# EAGLE design SoilMoistureMan (EAGLE 6.5.0)
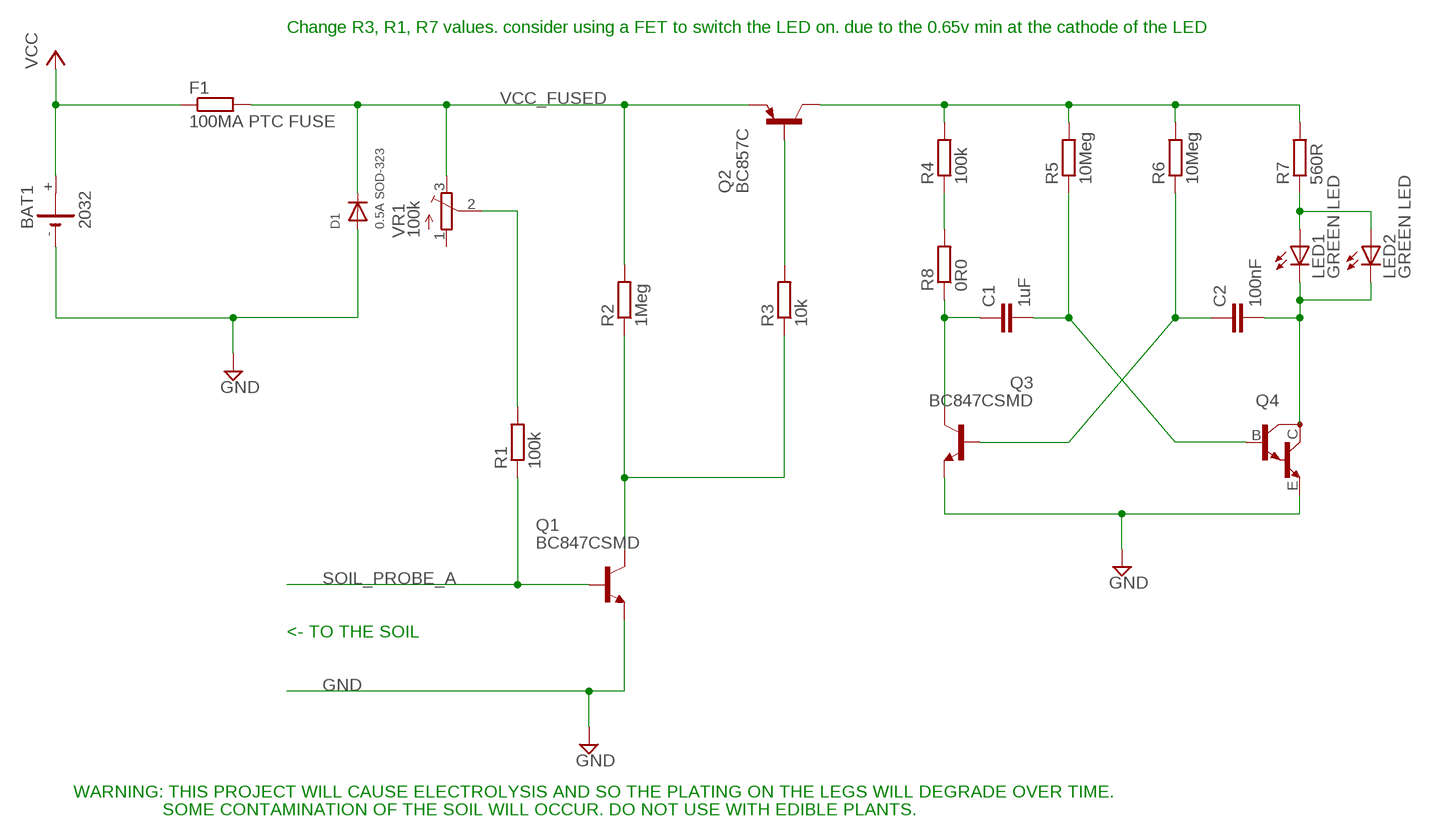
[diagram p0: schematic, sheet 1]

## Parts
BAT1  2032  [KZH20SMD]
C1  1uF  C-EUC0603  [C0603]
C2  100nF  C-EUC0603  [C0603]
D1  0.5A SOD-323  DIODESOD-323F  [SOD-323F]
F1  100MA PTC FUSE  R-EU_R0805  [R0805]
LED1  GREEN LED  LEDP-LCC-2  [P-LCC-2]
LED2  GREEN LED  LEDP-LCC-2  [P-LCC-2]
Q1  BC847CSMD  [SOT23]
Q2  BC857C  BC857C-PNP-SOT23-BEC  [SOT23-BEC]
Q3  BC847CSMD  [SOT23]
Q4  MMBTA13LT1  [SOT23-BEC]
R1  100k  R-EU_R0603  [R0603]
R2  1Meg  R-EU_R0603  [R0603]
R3  10k  R-EU_R0603  [R0603]
R4  100k  R-EU_R0603  [R0603]
R5  10Meg  R-EU_R0603  [R0603]
R6  10Meg  R-EU_R0603  [R0603]
R7  560R  R-EU_R0603  [R0603]
R8  0R0  R-EU_R0603  [R0603]
VR1  100k  TRIMPOTTC33X  [TC33X]

## Nets
GND: BAT1.- D1.A Q1.2(E) Q3.2(E) Q4.E
N$1: Q2.C R4.2 R5.2 R6.2 R7.2
N$2: R4.1 R8.2
N$3: Q2.B R3.2
N$5: LED1.A LED2.A R7.1
N$7: C1.1 Q3.3(C) R8.1
N$9: R1.2 VR1.2(S)
N$10: C2.1 Q3.1(B) R6.1
N$11: C2.2 LED1.C LED2.C Q4.C
N$12: C1.2 Q4.B R5.1
N$13: Q1.3(C) R2.1 R3.1
SOIL_PROBE_A: Q1.1(B) R1.1
VCC: BAT1.+ F1.1
VCC_FUSED: D1.C F1.2 Q2.E R2.2 VR1.3(E)
Unconnected: VR1.1(A)

## Notes on the sheet
- Change R3, R1, R7 values. consider using a FET to switch the LED on. due to the 0.65v min at the cathode of the LED
- <- TO THE SOIL
- WARNING: THIS PROJECT WILL CAUSE ELECTROLYSIS AND SO THE PLATING ON THE LEGS WILL DEGRADE OVER TIME.
- SOME CONTAMINATION OF THE SOIL WILL OCCUR. DO NOT USE WITH EDIBLE PLANTS.

## Library data of the parts
BAT1 = kzh20_lithium_batterie_holder:2032; MF: RENATA; MPN: SMTU 2032-LF; OC_FARNELL: 1216354
C1 = resistor:C-EU: CAPACITOR, European symbol; MF: TDK; MPN: C1608X5R1C105K080AA; OC_FARNELL: 2211167
C2 = resistor:C-EU: CAPACITOR, European symbol; MF: MULTICOMP; MPN: MC0603B104K160CT; OC_FARNELL: 1759016
D1 = adafruit:DIODE: Diode SMADIODE - SMA Surface Mount Package 20V 1A Schottky Diode Digikey: 641-1014-6-ND DO-1N4148 - Through Hole Small Current Diode SOD-123 20V 1 A (.5mV Vf) Schottky Diode - Digikey: MBRX120TPMSCT-ND SOD-323 10V 570mA (.38mV Vf, 3ns) Schottky Diode - Digikey: ZLLS410CT-ND SOD-523 30V 30mA Schottky Diode (RB751S-40TE61) - Digikey: RB751S-40TE61CT-ND SOT23-R/W - SOT23 Package (R = Solder Paste/Reflow Ovens, W = Hand-Soldering) BAT54Film 40V 300mA - Digikey: 497-7162-1-ND; MF: NXP; MPN: PMEG3010EJ,115; OC_FARNELL: 1757770
F1 = rcl:R-EU_: RESISTOR, European symbol; MF: BOURNS; MPN: MF-PSMF010X-2; OC_FARNELL: 1294873
LED1 LED2 = P-LCC-2_Shorter:LED: LED OSRAM: - CHIPLED LG R971, LG N971, LY N971, LG Q971, LY Q971, LO R971, LY R971 LH N974, LH R974 LS Q976, LO Q976, LY Q976 LO Q996 - Hyper CHIPLED LW Q18S LB Q993, LB Q99A, LB R99A - SideLED LS A670, LO A670, LY A670, LG A670, LP A670 LB A673, LV A673, LT A673, LW A673 LH A674 LY A675 LS A676, LA A676, LO A676, LY A676, LW A676 LS A679, LY A679, LG A679 - Hyper Micro SIDELED® LS Y876, LA Y876, LO Y876, LY Y876 LT Y87S - SmartLED LW L88C, LW L88S LB L89C, LB L89S, LG L890 LS L89K, LO L89K, LY L89K LS L896, LA L896, LO L896, LY L896 - TOPLED LS T670, LO T670, LY T670, LG T670, LP T670 LSG T670, LSP T670, LSY T670, LOP T670, LYG T670 LG T671, LOG T671, LSG T671 LB T673, LV T673, LT T673, LW T673 LH T674 LS T676, LA T676, LO T676, LY T676, LB T676, LH T676, LSB T676, LW T676 LB T67C, LV T67C, LT T67C, LS T67K, LO T67K, LY T67K, LW E67C LS E67B, LA E67B, LO E67B, LY E67B, LB E67C, LV E67C, LT E67C LW T67C LS T679, LY T679, LG T679 LS T770, LO T770, LY T770, LG T770, LP T770 LB T773, LV T773, LT T773, LW T773 LH T774 LS E675, LA E675, LY E675, LS T675 LS T776, LA T776, LO T776, LY T776, LB T776 LHGB T686 LT T68C, LB T68C - Hyper Mini TOPLED® LB M676 - Mini TOPLED Santana® LG M470 LS M47K, LO M47K, LY M47K Source: http://www.osram.convergy.de/; MF: OSRAM; MPN: LGT67K-H2K1-24-Z; OC_FARNELL: 1226376
Q1 Q3 = transistor-npn:BC847*: NPN Transistor; MF: DIODES INC.; MPN: BC847C-7-F; OC_FARNELL: 1773609
Q2 = transistor:*-PNP-: PNP Transistror; MF: DIODES INC.; MPN: BC857C-7-F; OC_FARNELL: 1773640
Q4 = transistor-npn:MMBTA13*: NPN Darlington Transistor; MF: FAIRCHILD SEMICONDUCTOR; MPN: BCV27; OC_FARNELL: 9846689
R1 R4 = resistor:R-EU_: RESISTOR, European symbol; MF: TE CONNECTIVITY; MPN: CRGH0603J100K; OC_FARNELL: 2331753
R2 = resistor:R-EU_: RESISTOR, European symbol; MF: TE CONNECTIVITY; MPN: CRGH0603J1M0; OC_FARNELL: 2331766
R3 = resistor:R-EU_: RESISTOR, European symbol; MF: BOURNS; MPN: CR0603-JW-103GLF; OC_FARNELL: 2333522
R5 R6 = resistor:R-EU_: RESISTOR, European symbol; MF: MULTICOMP; MPN: MC0063W0603110M0; OC_FARNELL: 2141628
R7 = resistor:R-EU_: RESISTOR, European symbol; MF: TE CONNECTIVITY; MPN: CRGH0603J560R; OC_FARNELL: 2331724
R8 = resistor:R-EU_: RESISTOR, European symbol; MF: MULTICOMP; MPN: MC0603SAF0000T5E; OC_FARNELL: 2309111
VR1 = P-LCC-2_Shorter:TRIMPOT: SMT trimmer potentiometer part number TC33X http://www.ladyada.net/library/eagle; MF: VISHAY SFERNICE; MPN: TS53YJ104MR10; OC_FARNELL: 1141488

## Net classes
0 default: width 0.305 mm, drill 0.508 mm, clearance 0.254 mm

## Board
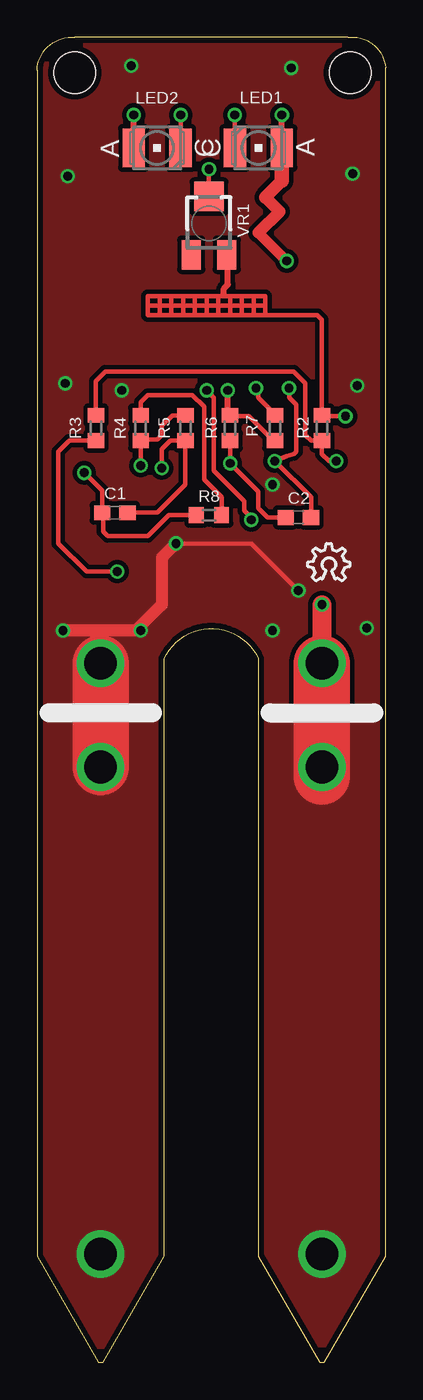
[diagram p1: board, top side]
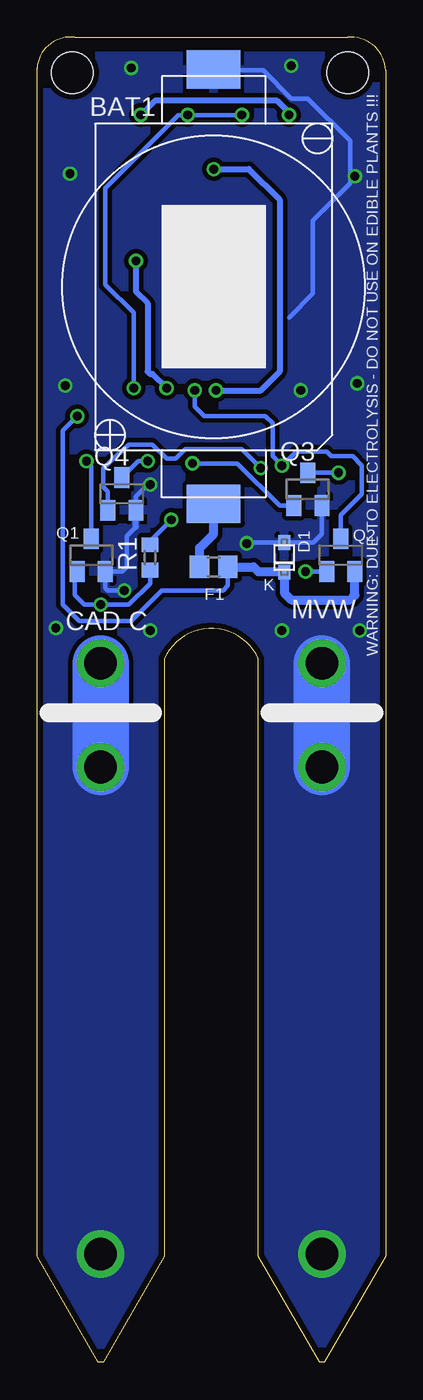
[diagram p2: board, bottom side, seen from below]

Size 23.5 x 89.39 mm. Coordinates in mm from the lower left corner, seen from the top.
Outline: 0,87.15 0,7.14 4.13,0 4.45,0 8.57,7.14 8.57,47.47 arc-131 14.92,47.47 14.92,7.14 19.05,0 19.37,0 23.5,7.14 23.5,87.31 arc93 20.95,89.38 2.54,89.38 arc93 0,87.15
Copper layers (1*16): Top 0.0356mm / dielectric 1.5011mm / Bottom 0.0356mm
Design rules "LaenPCBOrder": minimum track width 6mil, minimum drill 13mil, track to track 6mil, track to pad 6mil, pad to pad 6mil, via to via 6mil, smd to smd 6mil, copper to edge 15mil, drill to drill 6mil, minimum pad ring 7mil, minimum via ring 7mil, stop-mask expansion 3mil, vias tented up to drill 0mil, thermal gap 10mil
Holes 2.8 mm at 2.54,87 21.11,87

### Footprints (pad centres in the part's own frame; a part is rotated, then mirrored left to right if it is on the bottom)
KZH20SMD = smd 2.6 x 3.6: + 14.65,0; - -14.65,0
C0603 = smd 1.1 x 1: 1 -0.85,0; 2 0.85,0
SOD-323F = smd 1 x 0.8: A -1,0; C 1,0
R0805 = smd 1.3 x 1.5: 1 -0.95,0; 2 0.95,0
P-LCC-2 = smd 2.6 x 1.5: A 0,1.58; C 0,-1.58
SOT23 = smd 1 x 1.4: 1 -0.95,-1.1; 2 0.95,-1.1; 3 0,1.1
SOT23-BEC = smd 1 x 1.4: B -0.95,-1.1; C 0,1.1; E 0.95,-1.1
R0603 = smd 1 x 1.1: 1 -0.85,0; 2 0.85,0
TC33X = smd 1.3 x 2: 1 -1.2,-2.125; 3 1.2,-2.125 | smd 2 x 2: 2 0,1.8

### Placement (x,y rotation side)
BAT1  11.59,72.55 270 bottom
C1  5.24,57.31 0 top
C2  17.62,56.99 0 top
D1  6.83,54.29 270 bottom
F1  11.59,53.66 0 bottom
LED1  14.92,81.92 270 top
LED2  8.1,81.92 90 top
Q1  19.84,54.45 0 bottom
Q2  3.02,54.45 0 bottom
Q3  5.24,58.9 0 bottom
Q4  17.78,58.58 0 bottom
R1  15.88,54.29 90 bottom
R2  19.21,63.02 90 top
R3  3.97,63.02 270 top
R4  6.98,63.02 270 top
R5  10,63.02 90 top
R6  13.02,63.02 90 top
R7  16.03,63.02 270 top
R8  11.59,57.15 0 top
U$1  [OSHW_8X100_NOTEXT]  18.26,52.7 0 top
VR1  11.59,76.83 0 top

### Tracks (layer width: path | path; a pad name or v marks a point on that pad's centre or on a via)
GND  (via drill 0.6, 2.2)
  Top 0.305: v9.37,55.25 14.45,55.25 v17.62,52.07
  Top 0.813: 3.97,49.21 3.97,47.47 v4.29,47.15 | v9.37,55.25 8.41,54.29 8.41,51.12 6.67,49.37 v1.75,49.37
  Top 3.81: v4.29,47.15 v4.29,40.16
  Bottom 0.305: 16.83,56.36 17.46,55.72 17.46,53.66 17.77,53.35 Q1.2 18.89,52.23 18.73,52.07 v17.62,52.07 | v9.37,55.25 9.32,55.29 D1.A 4.87,55.29 4.29,55.88 Q3.2 | 6.51,70.49 4.92,72.07 4.92,76.99 2.38,79.53 2.38,82.39 5.24,85.25 6.35,85.25 8.25,87.15 11.54,87.15 BAT1.- | Q4.E 16.83,58.42 16.03,59.21 v15.88,59.21
  Bottom 0.406: 16.83,56.36 Q4.E
  Bottom 3.81: v4.29,40.16 v4.29,47.15
  other vias: 5.71,65.56 6.35,87.47 17.14,87.31 6.98,49.37 22.23,49.53 4.29,7.3 1.91,66.04 21.59,65.88 21.27,80.17 2.06,80.01 15.88,49.37
  pour Top (isolate 0.305, rank 2): -3.49,93.19 28.26,93.19 28.26,43.18 -3.49,43.02
  pour Bottom (isolate 0.305, rank 2): -3.65,88.11 27.3,88.11 27.46,43.18 -3.18,42.86 -3.18,47.62
  pour Top (isolate 0.305): -1.11,43.18 -1.59,7.78 4.13,-4.6 9.68,6.35 9.21,43.02
  pour Bottom (isolate 0.305): -1.43,43.02 -1.75,8.1 4.13,-4.29 9.84,7.46 9.21,43.02
N$1  (via drill 0.6)
  Top 0.305: v6.98,60.48 R4.2 7.04,62.23 8.1,62.23 8.41,62.55 8.41,63.18 9.11,63.87 R5.2 | R7.2 15.93,62.17 14.29,63.82 13.07,63.82 R6.2
  Top 0.406: R6.2 12.86,63.87 v12.86,65.56
  Bottom 0.305: Q2.C 3.02,57.15 1.59,58.58 1.59,60.48 2.22,61.12 3.65,61.12 3.97,61.44 6.03,61.44 v6.98,60.48 7.62,61.12 7.62,63.34 8.1,63.82 12.22,63.82 12.86,64.45 v12.86,65.56
N$2
  Top 0.305: R8.2 12.44,58.36 11.27,59.53 11.27,64.45 10.48,65.25 7.46,65.25 6.98,64.77 R4.1
N$3  (via drill 0.6)
  Top 0.305: v5.4,53.34 3.33,53.34 1.43,55.25 1.43,61.44 2.17,62.17 R3.2
  Bottom 0.305: Q2.B 5.39,53.35 v5.4,53.34
N$5  (via drill 0.6)
  Top 0.305: R7.1 16.03,63.98 14.92,65.09 14.92,65.56 v14.76,65.72
  Top 0.406: LED2.A v6.52,84.13 v6.51,84.14 | LED1.A v16.5,84.13 v16.51,84.14
  Top 0.61: LED1.A
  Top 0.711: 14.92,76.2 v16.83,74.3
  Top 0.762: 16.35,77.63 14.92,76.2
  Top 0.813: 15.4,78.58 16.35,77.63
  Top 0.864: 16.51,79.69 15.4,78.58
  Top 0.965: 16.51,79.69 LED1.A
  Bottom 0.406: v16.83,74.3 16.83,72.23 16.03,71.44 16.03,66.83 15.88,66.68 15.72,66.68 v14.76,65.72 | v6.51,84.14 6.51,84.3 7.3,85.09 15.56,85.09 v16.51,84.14
N$7  (via drill 0.6)
  Top 0.305: R8.1 8.89,57.15 7.46,55.72 4.76,55.72 4.45,56.04 4.45,57.25 C1.1 4.39,58.79 v3.17,60.01
  Bottom 0.305: Q3.3 v3.17,60.01
  Bottom 0.406: Q3.3
N$9  (via drill 0.6)
  Top 0.305: v14.45,56.83 14.45,56.99 13.97,57.47 13.97,58.1 11.91,60.17 11.91,65.09 v11.43,65.56 | v11.59,80.49 VR1.2
  Bottom 0.305: R1.2 15.88,55.4 v14.45,56.83
  Bottom 0.406: v11.43,65.56 8.41,65.56 7.14,66.83 7.14,78.42 9.21,80.49 v11.59,80.49
N$10  (via drill 0.6)
  Top 0.305: C2.1 15.56,56.99 14.92,57.63 14.92,58.74 v13.02,60.64 R6.1
  Bottom 0.305: v13.02,60.64 10,60.64 7.14,57.79 6.2,57.79 Q3.1
N$11  (via drill 0.6)
  Top 0.305: C2.2 18.47,58.36 v16.03,60.8 16.83,61.12 17.3,61.28 17.46,61.44 17.46,64.61 16.99,65.09 v16.99,65.72 | v9.68,84.14 LED2.C | v13.33,84.14 LED1.C
  Bottom 0.305: v9.68,84.14 v13.33,84.14 13.97,84.14 18.89,79.22 18.89,72.71 16.99,70.8 v16.99,65.72 | Q4.C 16.66,60.8 v16.03,60.8
N$12  (via drill 0.6)
  Top 0.305: C1.2 8.1,57.31 10,59.21 R5.1 8.99,62.17 8.41,61.6 v8.41,60.33
  Bottom 0.305: v8.41,60.33 9.68,61.6 13.49,61.6 14.13,60.96 14.76,60.96 15.72,61.91 17.3,61.91 19.05,60.33 19.05,59.06 18.73,58.74 Q4.B
N$13  (via drill 0.6)
  Top 0.305: v20.16,60.8 19.68,60.8 19.21,61.28 R2.1 18.47,62.17 18.1,62.55 18.1,66.04 17.3,66.83 4.6,66.83 3.97,66.2 R3.1
  Bottom 0.305: Q1.3 19.84,60.48 v20.16,60.8
SOIL_PROBE_A  (via drill 0.6, 2.2)
  Top 0.813: 19.21,46.51 18.89,45.72 18.57,45.72
  Top 1.27: v19.21,51.12 v19.21,47.15
  Top 3.81: 19.21,39.53 19.21,46.51 v19.21,47.15
  Bottom 0.305: R1.1 15.88,52.55 17.3,51.12 v19.21,51.12 20.32,51.12 20.95,51.75 20.95,53.19 Q1.1
  Bottom 3.81: v19.21,47.15 v19.21,40.16
  other vias: 19.21,7.3
  pour Top (isolate 0.305): 13.81,43.18 13.81,5.24 19.68,-4.29 25.56,5.4 25.24,43.34
  pour Bottom (isolate 0.305): 13.65,43.34 25.56,43.34 25.56,8.73 19.53,-4.76 13.02,8.73
VCC
  Bottom 0.61: F1.1 12.54,54.93 11.59,55.88 BAT1.+
VCC_FUSED  (via drill 0.6)
  Top 0.305: v20.8,63.82 19.27,63.82 R2.2 19.21,70.33 18.89,70.64 15.4,70.64 | 12.59,71.96 12.22,71.91 | 12.22,71.91 11.43,71.91 | 10.64,71.91 9.84,71.91 | 9.05,71.91 8.25,71.91 | 8.25,71.91 7.46,71.91 7.46,71.28 | 7.46,71.28 7.46,70.64 8.25,70.64 | 9.05,70.64 9.84,70.64 | 10.64,70.64 11.43,70.64 | 12.22,70.64 13.02,70.64 | 13.81,70.64 14.61,70.64 | 14.61,70.64 15.4,70.64 | 13.02,71.91 13.81,71.91 | 14.61,71.91 15.4,71.91 15.4,71.28 | 15.4,71.28 15.4,70.64 | 7.46,71.28 15.4,71.28 | 8.25,71.91 8.25,70.64 | 8.25,70.64 9.05,70.64 | 9.05,70.64 9.05,71.91 | 9.05,71.91 9.84,71.91 | 9.84,71.91 9.84,70.64 | 9.84,70.64 10.64,70.64 | 10.64,70.64 10.64,71.91 | 10.64,71.91 11.43,71.91 | 11.43,71.91 11.43,70.64 | 11.43,70.64 12.22,70.64 | 12.22,70.64 12.22,71.91 | 12.22,71.91 13.02,71.91 | 13.02,71.91 13.02,70.64 | 13.02,70.64 13.81,70.64 | 13.81,70.64 13.81,71.91 | 13.81,71.91 14.61,71.91 | 14.61,71.91 14.61,70.64
  Top 0.406: 12.59,71.96 12.59,72.44 12.86,72.71 12.86,74.64 VR1.3
  Bottom 0.305: F1.2 10.64,52.39 10.95,52.07 15.08,52.07 17.14,50.01 20.64,50.01 21.75,51.12 21.75,62.87 v20.8,63.82
  Bottom 0.61: F1.2 8.89,53.66 8.57,53.34 6.87,53.34 D1.C 6.83,51.91 6.35,51.44 2.38,51.44 2.06,51.75 Q2.E

### Text on the board
bPlace: WARNING: DUE TO ELECTROLYSIS - DO NOT USE ON EDIBLE PLANTS !!! | K | MVW | CAD C